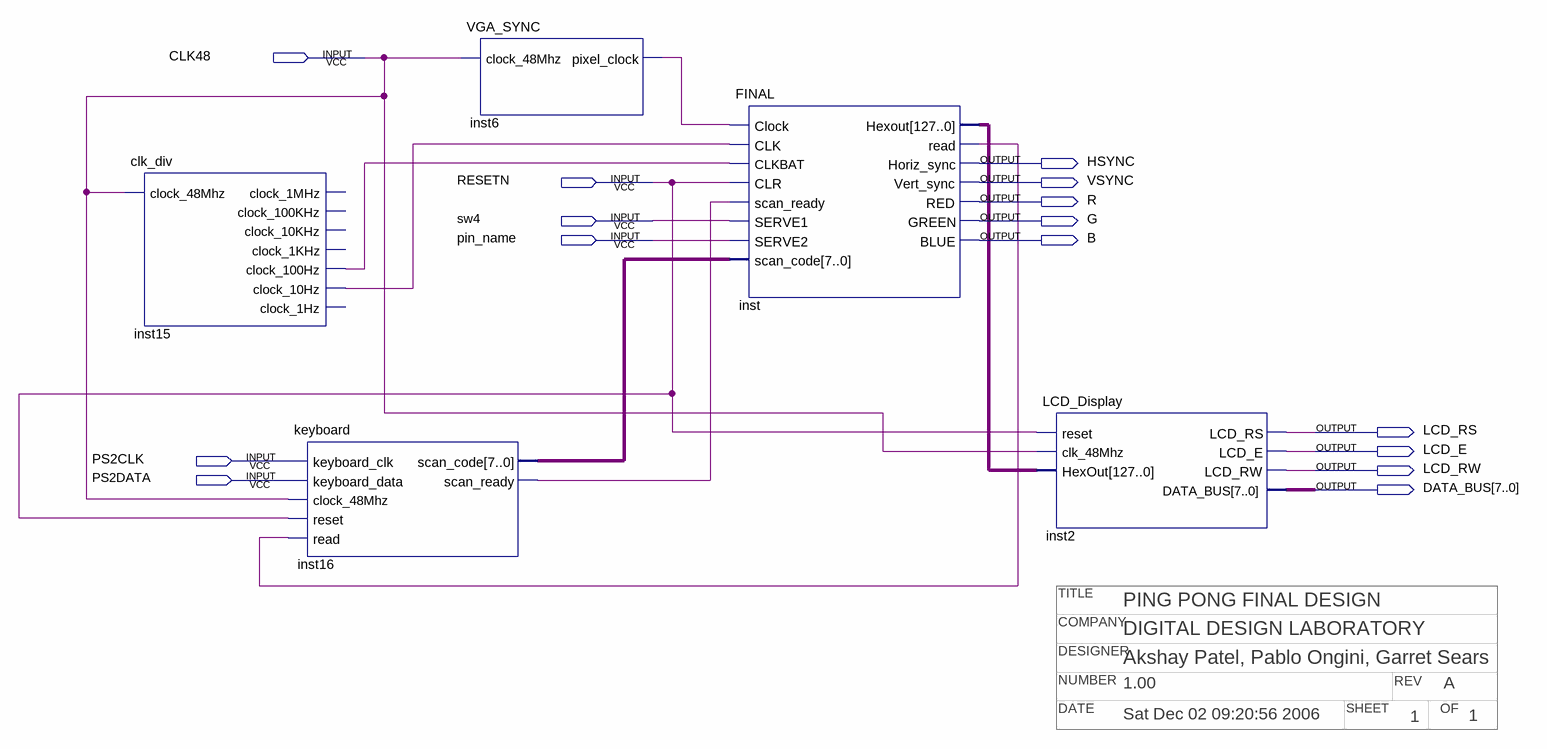
[diagram p0: schematic sheet]
// Quartus schematic design.bdf as structural Verilog: 5 symbols, 15 pins
// Title block: TITLE: PING PONG FINAL DESIGN; COMPANY: DIGITAL DESIGN LABORATORY; DESIGNER: Akshay Patel, Pablo Ongini, Garret Sears; NUMBER: 1.00; REV: A; DATE: Sat Dec 02 09:20:56 2006; SHEET: 1; OF: 1
module \design  (
  input  CLK48,
  input  RESETN,
  input  sw4,
  input  pin_name,
  input  PS2CLK,
  input  PS2DATA,
  output HSYNC,
  output VSYNC,
  output R,
  output G,
  output B,
  output LCD_RS,
  output LCD_E,
  output LCD_RW,
  output [7:0] DATA_BUS
);

  wire inst6_pixel_clock, inst15_clock_10hz, inst15_clock_100hz, inst16_scan_ready, inst_read;
  wire [7:0] inst16_scan_code;
  wire [127:0] inst_hexout;

  clk_div inst15 (
    .clock_48Mhz(CLK48), .clock_100Hz(inst15_clock_100hz), .clock_10Hz(inst15_clock_10hz));  // open: clock_1MHz, clock_100KHz, clock_10KHz, clock_1KHz, clock_1Hz
  keyboard inst16 (
    .keyboard_clk(PS2CLK), .keyboard_data(PS2DATA), .clock_48Mhz(CLK48), .reset(RESETN), .read(inst_read),
    .scan_code(inst16_scan_code), .scan_ready(inst16_scan_ready));
  VGA_SYNC inst6 (.clock_48Mhz(CLK48), .pixel_clock(inst6_pixel_clock));
  FINAL inst (
    .Clock(inst6_pixel_clock), .CLK(inst15_clock_10hz), .CLKBAT(inst15_clock_100hz), .CLR(RESETN),
    .scan_ready(inst16_scan_ready), .SERVE1(sw4), .SERVE2(pin_name), .scan_code(inst16_scan_code),
    .Hexout(inst_hexout), .read(inst_read), .Horiz_sync(HSYNC), .Vert_sync(VSYNC), .RED(R), .GREEN(G),
    .BLUE(B));
  LCD_Display inst2 (
    .reset(RESETN), .clk_48Mhz(CLK48), .HexOut(inst_hexout), .LCD_RS(LCD_RS), .LCD_E(LCD_E), .LCD_RW(LCD_RW),
    .DATA_BUS(DATA_BUS));
endmodule
